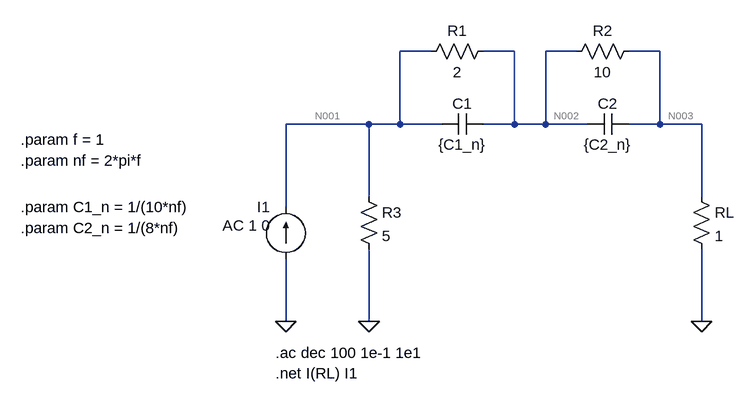
[diagram p0: schematic TPS12_ej1.asc]
TPS12_ej1.asc, the LTspice schematic file:
Version 4
SHEET 1 880 680
WIRE -992 -656 -1040 -656
WIRE -864 -656 -912 -656
WIRE -768 -656 -816 -656
WIRE -640 -656 -688 -656
WIRE -1088 -544 -1216 -544
WIRE -1040 -544 -1040 -656
WIRE -1040 -544 -1088 -544
WIRE -976 -544 -1040 -544
WIRE -864 -544 -864 -656
WIRE -864 -544 -912 -544
WIRE -816 -544 -816 -656
WIRE -816 -544 -864 -544
WIRE -752 -544 -816 -544
WIRE -640 -544 -640 -656
WIRE -640 -544 -688 -544
WIRE -576 -544 -640 -544
WIRE -1088 -432 -1088 -544
WIRE -576 -432 -576 -544
WIRE -1216 -416 -1216 -544
WIRE -1216 -240 -1216 -336
WIRE -1088 -240 -1088 -352
WIRE -576 -240 -576 -352
FLAG -1216 -240 0
FLAG -576 -240 0
FLAG -1088 -240 0
SYMBOL cap -912 -560 R90
WINDOW 0 0 32 VBottom 2
WINDOW 3 32 32 VTop 2
SYMATTR InstName C1
SYMATTR Value {C1_n}
SYMBOL cap -688 -560 R90
WINDOW 0 0 32 VBottom 2
WINDOW 3 32 32 VTop 2
SYMATTR InstName C2
SYMATTR Value {C2_n}
SYMBOL res -592 -448 R0
SYMATTR InstName RL
SYMATTR Value 1
SYMBOL res -1104 -448 R0
SYMATTR InstName R3
SYMATTR Value 5
SYMBOL res -896 -672 R90
WINDOW 0 0 56 VBottom 2
WINDOW 3 32 56 VTop 2
SYMATTR InstName R1
SYMATTR Value 2
SYMBOL res -672 -672 R90
WINDOW 0 0 56 VBottom 2
WINDOW 3 32 56 VTop 2
SYMATTR InstName R2
SYMATTR Value 10
SYMBOL current -1216 -336 R180
WINDOW 0 24 80 Left 2
WINDOW 3 24 0 Left 2
WINDOW 123 24 52 Left 2
WINDOW 39 0 0 Left 2
SYMATTR InstName I1
SYMATTR Value ""
SYMATTR Value2 AC 1 0
TEXT -1232 -192 Left 2 !.ac dec 100 1e-1 1e1
TEXT -1624 -416 Left 2 !.param C1_n = 1/(10*nf)
TEXT -1624 -384 Left 2 !.param C2_n = 1/(8*nf)
TEXT -1624 -520 Left 2 !.param f = 1
TEXT -1624 -488 Left 2 !.param nf = 2*pi*f
TEXT -1232 -160 Left 2 !.net I(RL) I1

The netlist it stands for:
* TPS12_ej1.asc
C1 N002 N001 {C1_n}
C2 N003 N002 {C2_n}
RL N003 0 1
R3 N001 0 5
R1 N002 N001 2
R2 N003 N002 10
I1 0 N001 AC 1 0
.ac dec 100 1e-1 1e1
.param C1_n = 1/(10*nf)
.param C2_n = 1/(8*nf)
.param f = 1
.param nf = 2*pi*f
.net I(RL) I1
.backanno
.end

* Results of the author's LTspice run, read from the files saved beside the schematic
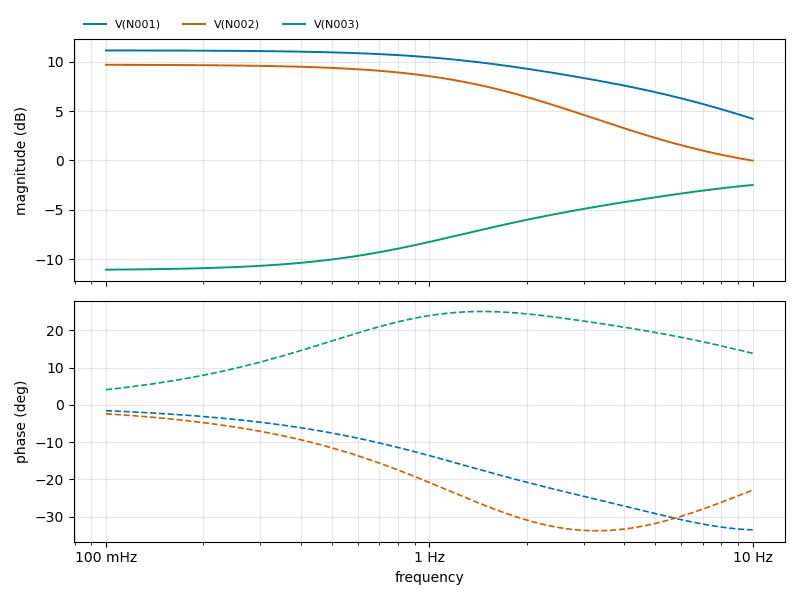
[diagram p1: AC Analysis of TPS12_ej1.asc, plotted from the saved traces]
* AC Analysis, 1 run:
*   V(N001): 11.14 dB at 100 mHz, 4.22 dB at 10 Hz, peak 11.14 dB at 100 mHz, 3 dB below the peak at 3.262 Hz
*   V(N002): 9.69 dB at 100 mHz, -0.02 dB at 10 Hz, peak 9.69 dB at 100 mHz, 3 dB below the peak at 1.877 Hz
*   V(N003): -11.07 dB at 100 mHz, -2.49 dB at 10 Hz, peak -2.49 dB at 10 Hz, 3 dB below the peak at 2.402 Hz